# Altium schematic sheet fpga2.SCHDOC: FPGA Second Part
size A2; Organization: Berne University of Applied Science; Address1: School of Engineering and; Address2: Information Technology; Address3: Quellgasse 21; Address4: CH-2501 Biel; Revision: 1.0; SheetNumber: 4; SheetTotal: 19; ApprovedBy: zem1; Author: zac1; PageSetup: Record=PageOptions|CenterHorizontal=True|CenterVertical=True|PrintScale=0.71|XCorrection=1.00|YCorrection=1.00|PrintKind=0|BorderSize=5000000|LeftOffset=0|BottomOffset=0|Orientation=2|PaperLength=1000|PaperWidth=1000|Scale=100|PaperSource=15|PrintQuality=4000|MediaType=1|DitherType=0|PaperKind=A3|PrintScaleMode=1
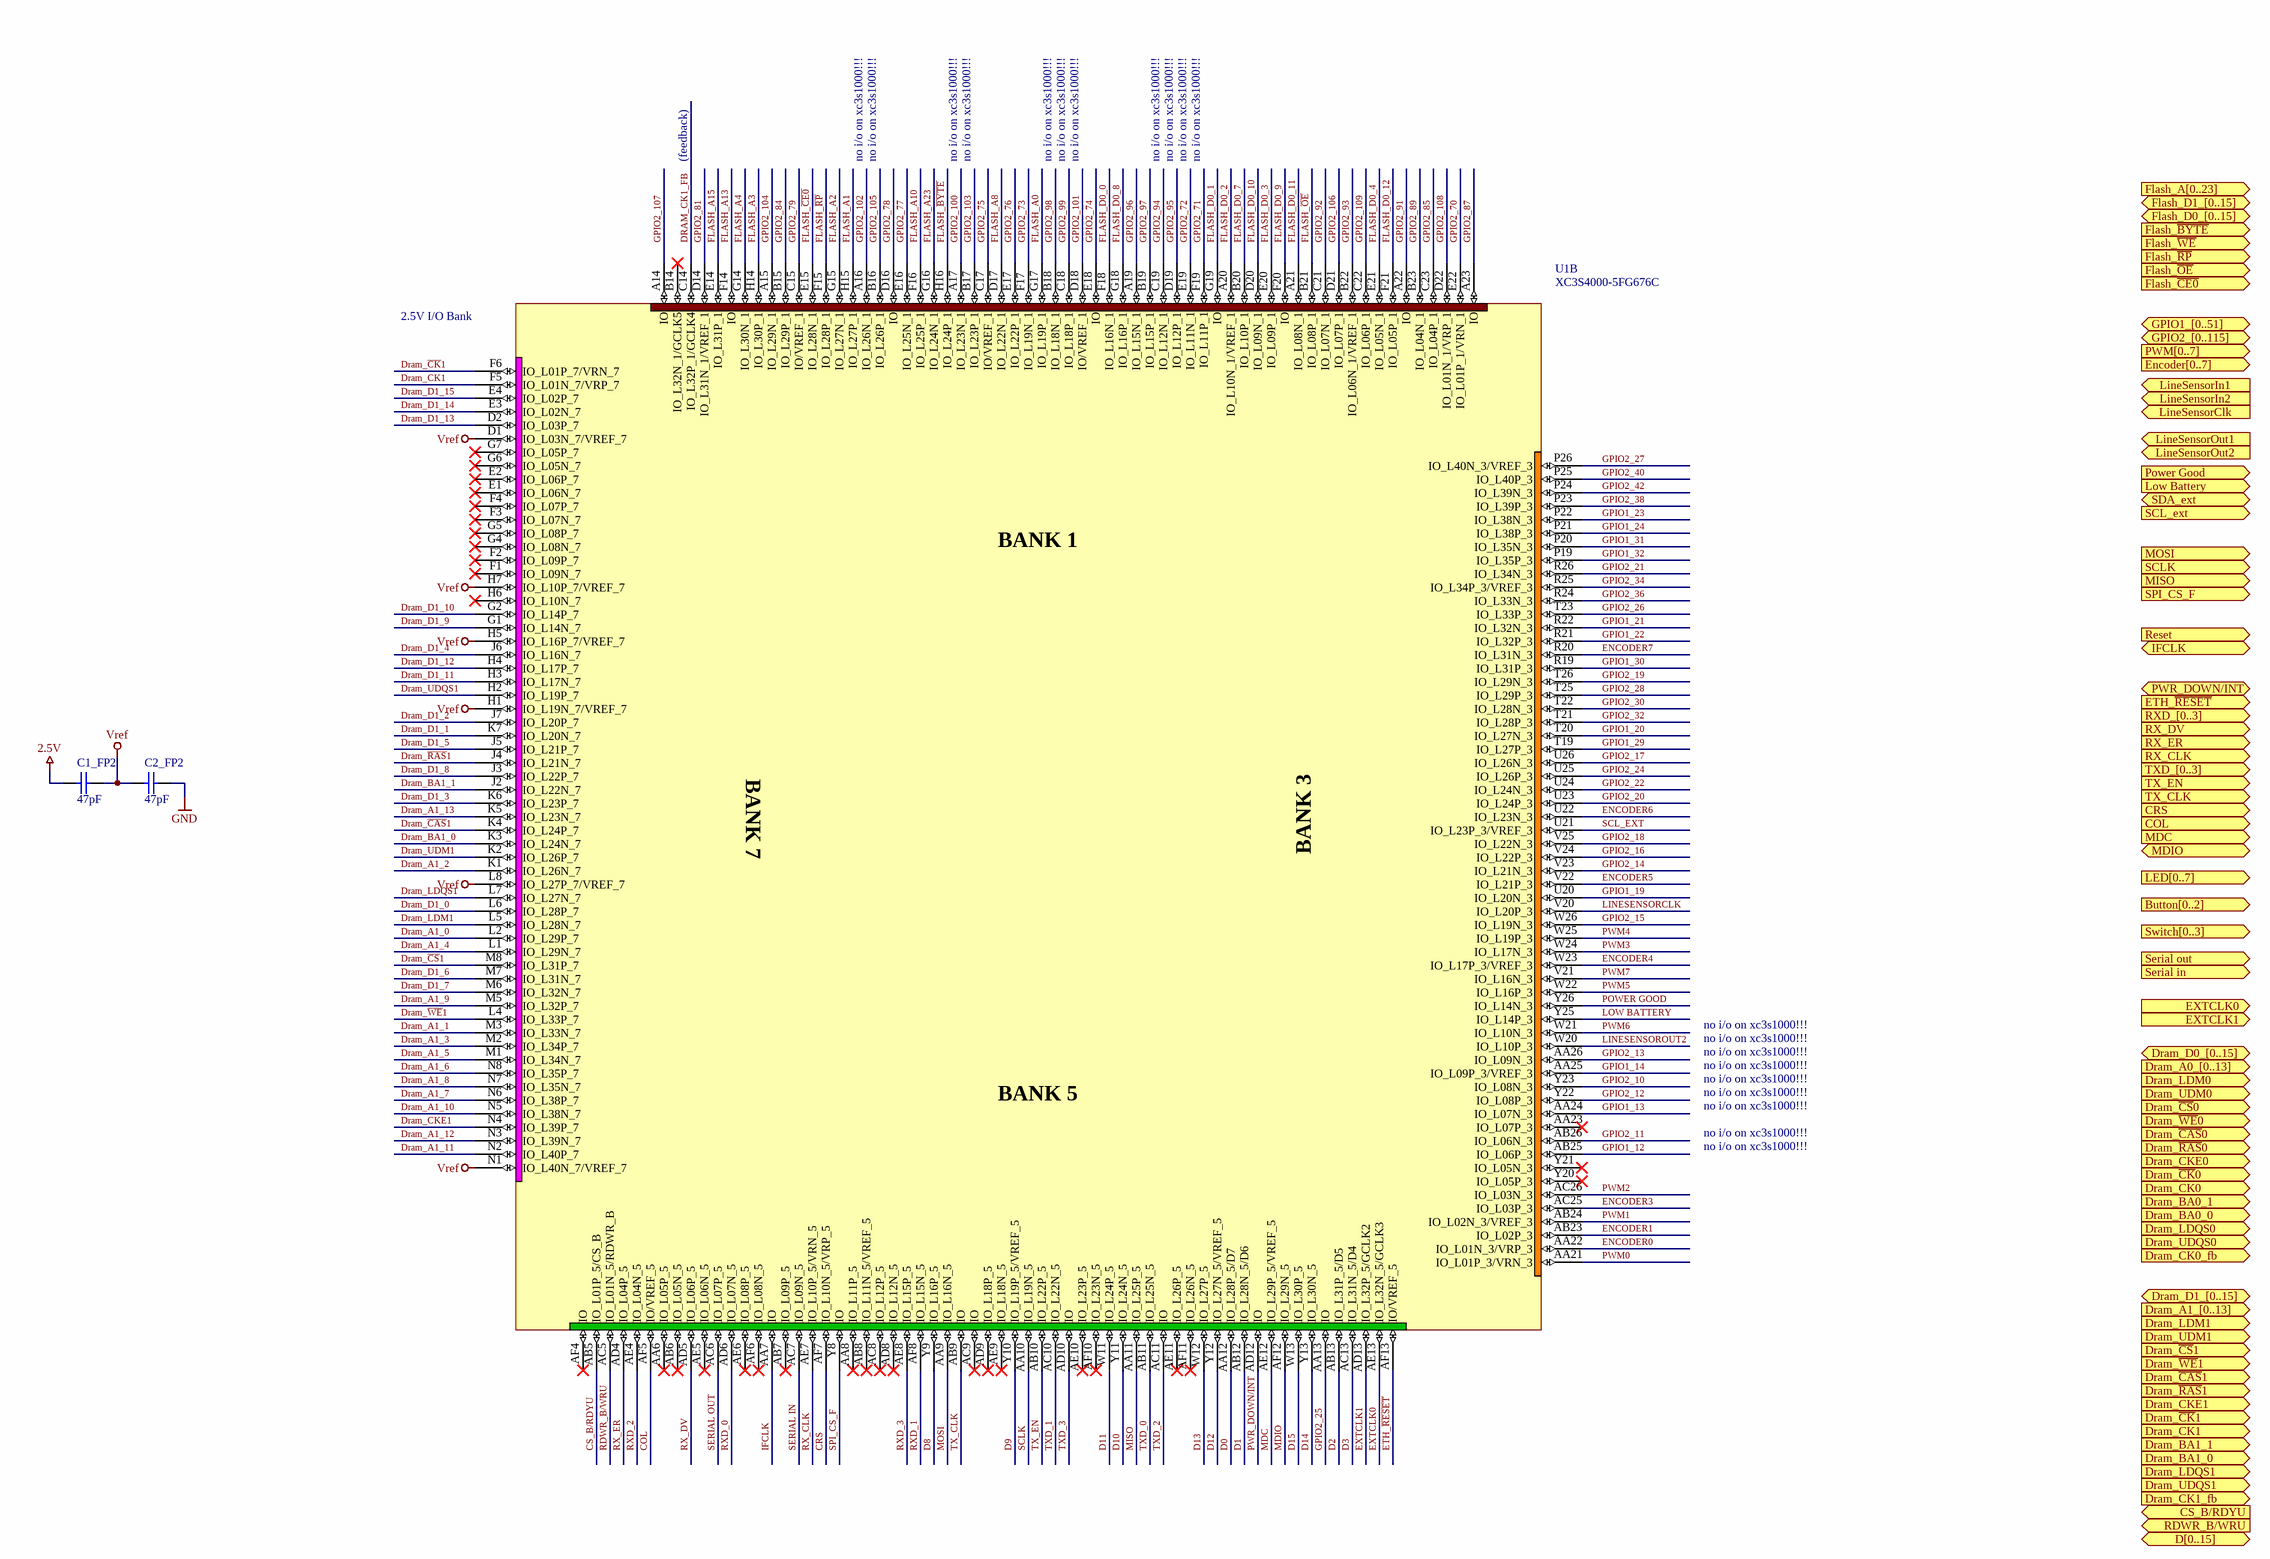
[diagram p0: fpga2.SCHDOC]

## Parts
C1_FP2  value 47pF  [0402]  (hidden comment: Cap)
C2_FP2  value 47pF  [0402]  (hidden comment: Cap)
U1  XC3S4000-5FG676C  [FG676]  (part B of 3)

## Ports
Button[0..2] (in), COL (in), CRS (in), CS_B/RDYU (in), D[0..15] (bidir), Dram_A0_[0..13] (out), Dram_A1_[0..13] (out), Dram_BA0_0 (out), Dram_BA0_1 (out), Dram_BA1_0 (out), Dram_BA1_1 (out), Dram_CK0 (out), Dram_CK0_fb (in), Dram_CK1 (out), Dram_CK1_fb (in), Dram_CKE0 (out), Dram_CKE1 (out), Dram_D0_[0..15] (bidir), Dram_D1_[0..15] (bidir), Dram_LDM0 (out), Dram_LDM1 (out), Dram_LDQS0 (out), Dram_LDQS1 (out), Dram_UDM0 (out), Dram_UDM1 (out), Dram_UDQS0 (out), Dram_UDQS1 (out), Dram_~{CAS}0 (out), Dram_~{CAS}1 (out), Dram_~{CK}0 (out), Dram_~{CK}1 (out), Dram_~{CS}0 (out), Dram_~{CS}1 (out), Dram_~{RAS}0 (out), Dram_~{RAS}1 (out), Dram_~{WE}0 (out), Dram_~{WE}1 (out), Encoder[0..7] (in), ETH_~{RESET} (out), EXTCLK0 (in), EXTCLK1 (in), Flash_A[0..23] (out), Flash_D0_[0..15] (bidir), Flash_D1_[0..15] (bidir), Flash_~{BYTE} (out), Flash_~{CE0} (out), Flash_~{OE} (out), Flash_~{RP} (out), Flash_~{WE} (out), GPIO1_[0..51] (bidir), GPIO2_[0..115] (bidir), IFCLK (bidir), LED[0..7] (out), LineSensorClk (out), LineSensorIn1 (out), LineSensorIn2 (out), LineSensorOut1 (in), LineSensorOut2 (in), Low Battery (in), MDC (out), MDIO (bidir), MISO (in), MOSI (in), Power Good (in), PWM[0..7] (out), PWR_DOWN/INT (bidir), RDWR_B/WRU (in), Reset (in), RX_CLK (in), RX_DV (in), RX_ER (in), RXD_[0..3] (in), SCL_ext (out), SCLK (in), SDA_ext (bidir), Serial in (in), Serial out (out), SPI_CS_F (in), Switch[0..3] (in), TX_CLK (in), TX_EN (out), TXD_[0..3] (out)

## Nets
2.5V: C1_FP2.2
GND: C2_FP2.1
Vref: C1_FP2.1 C2_FP2.2 U1.D1(IO_L03N_7/VREF_7) U1.H1(IO_L19N_7/VREF_7) U1.H5(IO_L16P_7/VREF_7) U1.H7(IO_L10P_7/VREF_7) U1.L8(IO_L27P_7/VREF_7) U1.N1(IO_L40N_7/VREF_7)
COL: U1.AF5(IO/VREF_5)
CRS: U1.AF7(IO_L10N_5/VRP_5)
CS_B/RDYU: U1.AB5(IO_L01P_5/CS_B)
D0: U1.AA12(IO_L28P_5/D7)
D1: U1.AB12(IO_L28N_5/D6)
D2: U1.AB13(IO_L31P_5/D5)
D3: U1.AC13(IO_L31N_5/D4)
D8: U1.Y9(IO_L16P_5)
D9: U1.Y10(IO_L19P_5/VREF_5)
D10: U1.Y11(IO_L24N_5)
D11: U1.W11(IO_L24P_5)
D12: U1.Y12(IO_L27N_5/VREF_5)
D13: U1.W12(IO_L27P_5)
D14: U1.Y13(IO_L30N_5)
D15: U1.W13(IO_L30P_5)
Dram_A1_0: U1.L2(IO_L29P_7)
Dram_A1_1: U1.M3(IO_L33N_7)
Dram_A1_2: U1.K1(IO_L26N_7)
Dram_A1_3: U1.M2(IO_L34P_7)
Dram_A1_4: U1.L1(IO_L29N_7)
Dram_A1_5: U1.M1(IO_L34N_7)
Dram_A1_6: U1.N8(IO_L35P_7)
Dram_A1_7: U1.N6(IO_L38P_7)
Dram_A1_8: U1.N7(IO_L35N_7)
Dram_A1_9: U1.M5(IO_L32P_7)
Dram_A1_10: U1.N5(IO_L38N_7)
Dram_A1_11: U1.N2(IO_L40P_7)
Dram_A1_12: U1.N3(IO_L39N_7)
Dram_A1_13: U1.K5(IO_L23N_7)
Dram_BA1_0: U1.K3(IO_L24N_7)
Dram_BA1_1: U1.J2(IO_L22N_7)
Dram_~{CAS}1: U1.K4(IO_L24P_7)
Dram_~{CK}1: U1.F6(IO_L01P_7/VRN_7)
Dram_~{CS}1: U1.M8(IO_L31P_7)
Dram_CK1: U1.F5(IO_L01N_7/VRP_7)
DRAM_CK1_FB: U1.C14(IO_L32P_1/GCLK4)
Dram_CKE1: U1.N4(IO_L39P_7)
Dram_D1_0: U1.L6(IO_L28P_7)
Dram_D1_1: U1.K7(IO_L20N_7)
Dram_D1_2: U1.J7(IO_L20P_7)
Dram_D1_3: U1.K6(IO_L23P_7)
Dram_D1_4: U1.J6(IO_L16N_7)
Dram_D1_5: U1.J5(IO_L21P_7)
Dram_D1_6: U1.M7(IO_L31N_7)
Dram_D1_7: U1.M6(IO_L32N_7)
Dram_D1_8: U1.J3(IO_L22P_7)
Dram_D1_9: U1.G1(IO_L14N_7)
Dram_D1_10: U1.G2(IO_L14P_7)
Dram_D1_11: U1.H3(IO_L17N_7)
Dram_D1_12: U1.H4(IO_L17P_7)
Dram_D1_13: U1.D2(IO_L03P_7)
Dram_D1_14: U1.E3(IO_L02N_7)
Dram_D1_15: U1.E4(IO_L02P_7)
Dram_LDM1: U1.L5(IO_L28N_7)
Dram_LDQS1: U1.L7(IO_L27N_7)
Dram_~{RAS}1: U1.J4(IO_L21N_7)
Dram_UDM1: U1.K2(IO_L26P_7)
Dram_UDQS1: U1.H2(IO_L19P_7)
Dram_~{WE}1: U1.L4(IO_L33P_7)
ENCODER0: U1.AA22(IO_L01N_3/VRP_3)
ENCODER1: U1.AB23(IO_L02P_3)
ENCODER3: U1.AC25(IO_L03P_3)
ENCODER4: U1.W23(IO_L17P_3/VREF_3)
ENCODER5: U1.V22(IO_L21P_3)
ENCODER6: U1.U22(IO_L23N_3)
ENCODER7: U1.R20(IO_L31N_3)
ETH_~{RESET}: U1.AF13(IO/VREF_5)
EXTCLK0: U1.AE13(IO_L32N_5/GCLK3)
EXTCLK1: U1.AD13(IO_L32P_5/GCLK2)
FLASH_A0: U1.G17(IO_L19P_1)
FLASH_A1: U1.H15(IO_L27P_1)
FLASH_A2: U1.G15(IO_L27N_1)
FLASH_A3: U1.H14(IO_L30P_1)
FLASH_A4: U1.G14(IO_L30N_1)
FLASH_A8: U1.D17(IO_L22N_1)
FLASH_A10: U1.F16(IO_L25P_1)
FLASH_A13: U1.F14(IO)
FLASH_A15: U1.E14(IO_L31P_1)
FLASH_A23: U1.G16(IO_L24N_1)
FLASH_~{BYTE}: U1.H16(IO_L24P_1)
FLASH_~{CE0}: U1.E15(IO_L28N_1)
FLASH_D0_0: U1.F18(IO_L16N_1)
FLASH_D0_1: U1.G19(IO)
FLASH_D0_2: U1.A20(IO_L10N_1/VREF_1)
FLASH_D0_3: U1.E20(IO_L09P_1)
FLASH_D0_4: U1.E21(IO_L05N_1)
FLASH_D0_7: U1.B20(IO_L10P_1)
FLASH_D0_8: U1.G18(IO_L16P_1)
FLASH_D0_9: U1.F20(IO)
FLASH_D0_10: U1.D20(IO_L09N_1)
FLASH_D0_11: U1.A21(IO_L08N_1)
FLASH_D0_12: U1.F21(IO_L05P_1)
FLASH_~{OE}: U1.B21(IO_L08P_1)
FLASH_~{RP}: U1.F15(IO_L28P_1)
GPIO1_12: U1.AB25(IO_L06P_3)
GPIO1_13: U1.AA24(IO_L07N_3)
GPIO1_14: U1.AA25(IO_L09P_3/VREF_3)
GPIO1_19: U1.U20(IO_L20N_3)
GPIO1_20: U1.T20(IO_L27N_3)
GPIO1_21: U1.R22(IO_L32N_3)
GPIO1_22: U1.R21(IO_L32P_3)
GPIO1_23: U1.P22(IO_L38N_3)
GPIO1_24: U1.P21(IO_L38P_3)
GPIO1_29: U1.T19(IO_L27P_3)
GPIO1_30: U1.R19(IO_L31P_3)
GPIO1_31: U1.P20(IO_L35N_3)
GPIO1_32: U1.P19(IO_L35P_3)
GPIO2_10: U1.Y23(IO_L08N_3)
GPIO2_11: U1.AB26(IO_L06N_3)
GPIO2_12: U1.Y22(IO_L08P_3)
GPIO2_13: U1.AA26(IO_L09N_3)
GPIO2_14: U1.V23(IO_L21N_3)
GPIO2_15: U1.W26(IO_L19N_3)
GPIO2_16: U1.V24(IO_L22P_3)
GPIO2_17: U1.U26(IO_L26N_3)
GPIO2_18: U1.V25(IO_L22N_3)
GPIO2_19: U1.T26(IO_L29N_3)
GPIO2_20: U1.U23(IO_L24P_3)
GPIO2_21: U1.R26(IO_L34N_3)
GPIO2_22: U1.U24(IO_L24N_3)
GPIO2_24: U1.U25(IO_L26P_3)
GPIO2_25: U1.AA13(IO)
GPIO2_26: U1.T23(IO_L33P_3)
GPIO2_27: U1.P26(IO_L40N_3/VREF_3)
GPIO2_28: U1.T25(IO_L29P_3)
GPIO2_30: U1.T22(IO_L28N_3)
GPIO2_32: U1.T21(IO_L28P_3)
GPIO2_34: U1.R25(IO_L34P_3/VREF_3)
GPIO2_36: U1.R24(IO_L33N_3)
GPIO2_38: U1.P23(IO_L39P_3)
GPIO2_40: U1.P25(IO_L40P_3)
GPIO2_42: U1.P24(IO_L39N_3)
GPIO2_70: U1.E22(IO_L01P_1/VRN_1)
GPIO2_71: U1.F19(IO_L11P_1)
GPIO2_72: U1.E19(IO_L11N_1)
GPIO2_73: U1.F17(IO_L19N_1)
GPIO2_74: U1.E18(IO)
GPIO2_75: U1.C17(IO/VREF_1)
GPIO2_76: U1.E17(IO_L22P_1)
GPIO2_77: U1.E16(IO_L25N_1)
GPIO2_78: U1.D16(IO)
GPIO2_79: U1.C15(IO/VREF_1)
GPIO2_81: U1.D14(IO_L31N_1/VREF_1)
GPIO2_84: U1.B15(IO_L29P_1)
GPIO2_85: U1.C23(IO_L04P_1)
GPIO2_87: U1.A23(IO)
GPIO2_89: U1.B23(IO_L04N_1)
GPIO2_91: U1.A22(IO)
GPIO2_92: U1.C21(IO_L07N_1)
GPIO2_93: U1.B22(IO_L06N_1/VREF_1)
GPIO2_94: U1.C19(IO_L12N_1)
GPIO2_95: U1.D19(IO_L12P_1)
GPIO2_96: U1.A19(IO_L15N_1)
GPIO2_97: U1.B19(IO_L15P_1)
GPIO2_98: U1.B18(IO_L18N_1)
GPIO2_99: U1.C18(IO_L18P_1)
GPIO2_100: U1.A17(IO_L23N_1)
GPIO2_101: U1.D18(IO/VREF_1)
GPIO2_102: U1.A16(IO_L26N_1)
GPIO2_103: U1.B17(IO_L23P_1)
GPIO2_104: U1.A15(IO_L29N_1)
GPIO2_105: U1.B16(IO_L26P_1)
GPIO2_106: U1.D21(IO_L07P_1)
GPIO2_107: U1.A14(IO)
GPIO2_108: U1.D22(IO_L01N_1/VRP_1)
GPIO2_109: U1.C22(IO_L06P_1)
IFCLK: U1.AA7(IO)
LINESENSORCLK: U1.V20(IO_L20P_3)
LINESENSOROUT2: U1.W20(IO_L10P_3)
LOW BATTERY: U1.Y25(IO_L14P_3)
MDC: U1.AE12(IO_L29P_5/VREF_5)
MDIO: U1.AF12(IO_L29N_5)
MISO: U1.AA11(IO_L25P_5)
MOSI: U1.AA9(IO_L16N_5)
POWER GOOD: U1.Y26(IO_L14N_3)
PWM0: U1.AA21(IO_L01P_3/VRN_3)
PWM1: U1.AB24(IO_L02N_3/VREF_3)
PWM2: U1.AC26(IO_L03N_3)
PWM3: U1.W24(IO_L17N_3)
PWM4: U1.W25(IO_L19P_3)
PWM5: U1.W22(IO_L16P_3)
PWM6: U1.W21(IO_L10N_3)
PWM7: U1.V21(IO_L16N_3)
PWR_DOWN/INT: U1.AD12(IO)
RDWR_B/WRU: U1.AC5(IO_L01N_5/RDWR_B)
RX_CLK: U1.AE7(IO_L10P_5/VRN_5)
RX_DV: U1.AD5(IO_L06P_5)
RX_ER: U1.AD4(IO_L04P_5)
RXD_0: U1.AD6(IO_L07N_5)
RXD_1: U1.AF8(IO_L15N_5)
RXD_2: U1.AE4(IO_L04N_5)
RXD_3: U1.AE8(IO_L15P_5)
SCL_EXT: U1.U21(IO_L23P_3/VREF_3)
SCLK: U1.AA10(IO_L19N_5)
SERIAL IN: U1.AC7(IO_L09N_5)
SERIAL OUT: U1.AC6(IO_L07P_5)
SPI_CS_F: U1.Y8(IO)
TX_CLK: U1.AB9(IO)
TX_EN: U1.AB10(IO_L22P_5)
TXD_0: U1.AB11(IO_L25N_5)
TXD_1: U1.AC10(IO_L22N_5)
TXD_2: U1.AC11(IO)
TXD_3: U1.AD10(IO)

Not connected (* = marked no-connect by the designer): U1 AA6(IO_L05P_5)* AA8(IO_L11P_5)* AA23(IO_L07P_3)* AB6(IO_L05N_5)* AB7(IO_L09P_5)* AB8(IO_L11N_5/VREF_5)* AC8(IO_L12P_5)* AC9(IO)* AD8(IO_L12N_5)* AD9(IO_L18P_5)* AE5(IO_L06N_5)* AE6(IO_L08P_5)* AE9(IO_L18N_5)* AE10(IO_L23P_5)* AE11(IO_L26P_5)* AF4(IO)* AF6(IO_L08N_5)* AF10(IO_L23N_5)* AF11(IO_L26N_5)* B14(IO_L32N_1/GCLK5)* E1(IO_L06N_7)* E2(IO_L06P_7)* F1(IO_L09N_7)* F2(IO_L09P_7)* F3(IO_L07N_7)* F4(IO_L07P_7)* G4(IO_L08N_7)* G5(IO_L08P_7)* G6(IO_L05N_7)* G7(IO_L05P_7)* H6(IO_L10N_7)* Y20(IO_L05P_3)* Y21(IO_L05N_3)*

## Notes on the sheet
- (feedback)
- no i/o on xc3s1000!!!
- (near U1) 2.5V I/O Bank
- Title:
- Size:
- Date:
- File:
- A2_L
- Author:
- Time:
- Revision:
- Sheet
- of
- (in symbol XC3S1500-5FG676C, part B) BANK 1; BANK 7; BANK 3; BANK 5

## Library data of the parts
C1_FP2 C2_FP2 = Cap: Capacitor; Manufacturer: Murata; Part Number: GRM1555C1H470JZ01D; Class I: Passive; Currency: CHF; Packaging unit: 10; Prize: 0.07; Published: 8-Jun-2000; Revision: July-2002: Re-released for DXP Platform.; Publisher: Altium Limited; Class II: Capacitor; Distributor Number: 8819 670; RoHS: yes; Distributor: Farnell
U1 = XC3S1500-5FG676C: Spartan-3 1.2V FPGA, 487 User I/Os, 676-ball FBGA, High Performance, Commercial Grade; Manufacturer: Xilinx; PackageDocument: ver1.1, Apr-2001; Currency: CHF; lead time: 6 Weeks; Packaging unit: 40; Prize: 184.72; Published: 17-Sep-2003; LatestRevisionDate: 6-Jun-2005; LatestRevisionNote: Bubble removed from PROG_B pin.; DatasheetDocument: 04-Mar-2004; PackageReference: FG676; Publisher: Altium Limited; Code_JEDEC: MS-034-AAL-1; Code_IPC: PBGA 27X27 FE676; ComponentLink1Description: Manufacturer Link; ComponentLink1URL: http://www.xilinx.com/xlnx/xil_prodcat_landingpage.jsp?title=Spartan-3; ComponentLink2Description: Datasheet; ComponentLink2URL: http://direct.xilinx.com/bvdocs/publications/ds099.pdf; Value: XC3S4000-5FG676C; Distributor Number: XC3S40005FGG676C; Part Number: XC3S4000-5FG676C; RoHS: yes; Distributor: Silica